# Altium schematic sheet DoserController.SchDoc
size A
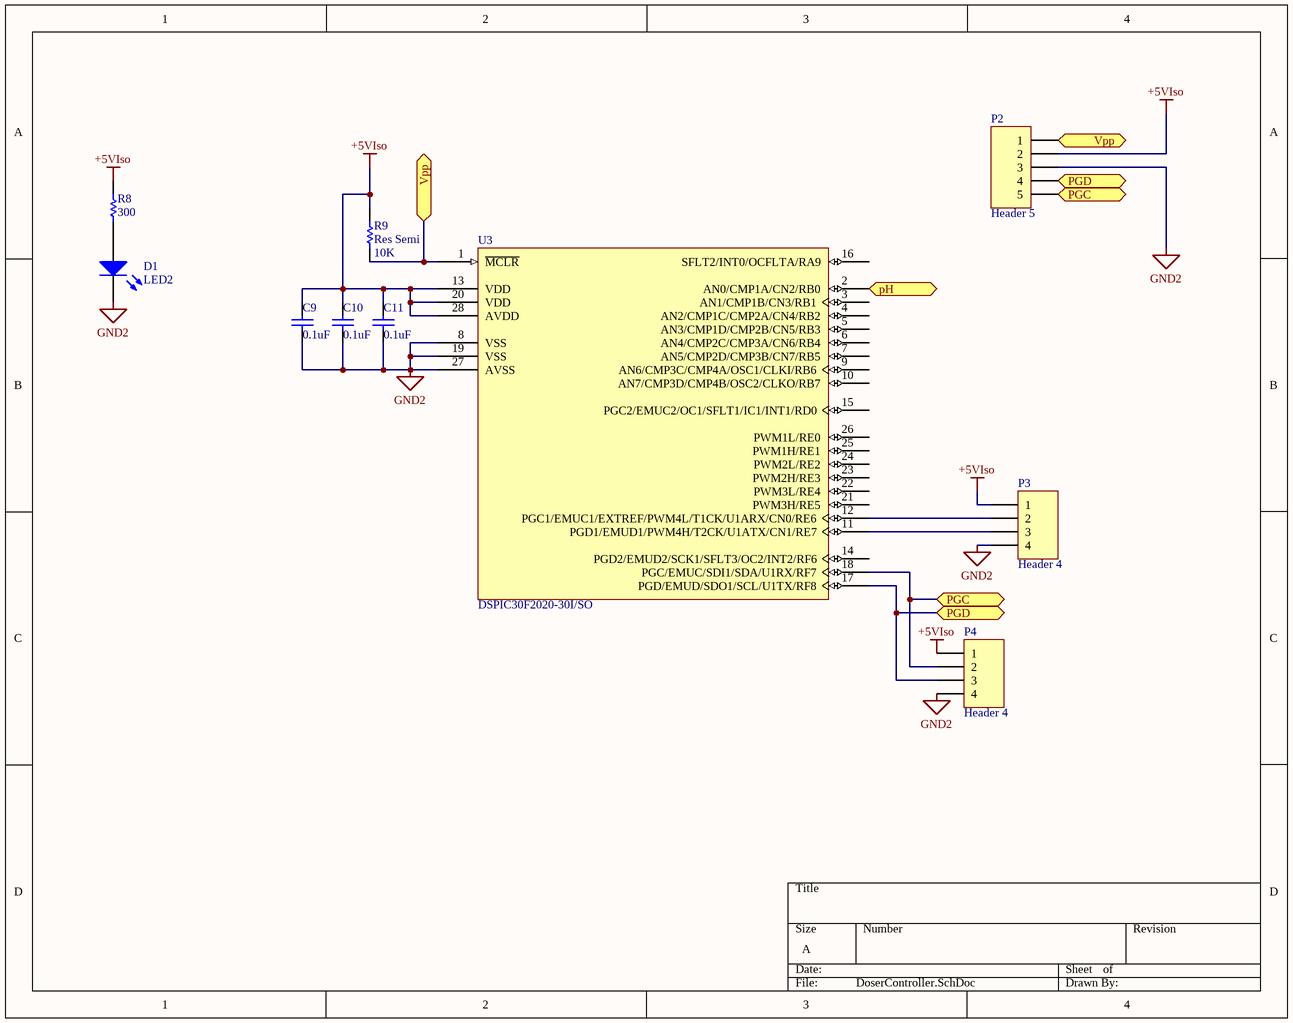
[diagram p0: DoserController.SchDoc]

## Parts
C9  value 0.1uF  [RESC2012L]  (hidden comment: Cap)
C10  value 0.1uF  [RESC2012L]  (hidden comment: Cap)
C11  value 0.1uF  [RESC2012L]  (hidden comment: Cap)
D1  LED2  [DSO-C2/D5.6]
P2  Header 5  [HDR1X5]
P3  Header 4  [HDR1X4]
P4  Header 4  [HDR1X4]
R8  value 300  [RESC2012L]  (hidden comment: Res1)
R9  Res Semi  value 10K  [RESC2012L]
U3  DSPIC30F2020-30I/SO  [SOIC-SO28_N]

## Ports
PGC, PGD, pH, Vpp

## Nets
+5VIso: C9.2 C10.2 C11.2 P2.2 P3.1 P4.1 R8.2 R9.2 U3.13(VDD) U3.20(VDD) U3.28(AVDD)
GND2: C9.1 C10.1 C11.1 D1.2(K) P2.3 P3.4 P4.4 U3.8(VSS) U3.19(VSS) U3.27(AVSS)
PGC: P2.5 P4.2 U3.18(PGC/EMUC/SDI1/SDA/U1RX/RF7) ; port PGC
PGD: P2.4 P4.3 U3.17(PGD/EMUD/SDO1/SCL/U1TX/RF8) ; port PGD
pH: U3.2(AN0/CMP1A/CN2/RB0) ; port pH
Vpp: P2.1 R9.1 U3.1(~{MCLR}) ; port Vpp
NetD1_1: D1.1(A) R8.1
NetP3_2: P3.2 U3.12(PGC1/EMUC1/EXTREF/PWM4L/T1CK/U1ARX/CN0/RE6)
NetP3_3: P3.3 U3.11(PGD1/EMUD1/PWM4H/T2CK/U1ATX/CN1/RE7)

Not connected (* = marked no-connect by the designer): U3 3(AN1/CMP1B/CN3/RB1) 4(AN2/CMP1C/CMP2A/CN4/RB2) 5(AN3/CMP1D/CMP2B/CN5/RB3) 6(AN4/CMP2C/CMP3A/CN6/RB4) 7(AN5/CMP2D/CMP3B/CN7/RB5) 9(AN6/CMP3C/CMP4A/OSC1/CLKI/RB6) 10(AN7/CMP3D/CMP4B/OSC2/CLKO/RB7) 14(PGD2/EMUD2/SCK1/SFLT3/OC2/INT2/RF6) 15(PGC2/EMUC2/OC1/SFLT1/IC1/INT1/RD0) 16(SFLT2/INT0/OCFLTA/RA9) 21(PWM3H/RE5) 22(PWM3L/RE4) 23(PWM2H/RE3) 24(PWM2L/RE2) 25(PWM1H/RE1) 26(PWM1L/RE0)

## Library data of the parts
C9-C11 = Cap: Capacitor; Published: 8-Jun-2000; LatestRevisionDate: 17-Jul-2002; LatestRevisionNote: Re-released for DXP Platform.; PackageReference: RAD-0.3; Publisher: Altium Limited
D1 = LED2: Typical RED, GREEN, YELLOW, AMBER GaAs LED; Published: 8-Jun-2000; LatestRevisionDate: 17-Jul-2002; LatestRevisionNote: Re-released for DXP Platform.; PackageVersion: Feb-2002; PackageReference: 3.2X1.6X1.1; Publisher: Altium Limited
P2 = Header 5: Header, 5-Pin; LatestRevisionDate: 17-Jul-2002; LatestRevisionNote: Re-released for DXP Platform.; Publisher: Altium Limited
P3 P4 = Header 4: Header, 4-Pin; LatestRevisionDate: 17-Jul-2002; LatestRevisionNote: Re-released for DXP Platform.; Publisher: Altium Limited
R8 = Res1: Resistor; Published: 8-Jun-2000; LatestRevisionDate: 17-Jul-2002; LatestRevisionNote: Re-released for DXP Platform.; PackageReference: AXIAL-0.3; Publisher: Altium Limited
R9 = Res Semi: Semiconductor Resistor; Published: 8-Jun-2000; LatestRevisionDate: 17-Jul-2002; LatestRevisionNote: Re-released for DXP Platform.; PackageReference: AXIAL-0.5; Publisher: Altium Limited
U3 = DSPIC30F2020-30I/SO: High-Performance 16-bit Digital Signal Controller with Switch Mode Power Supply, 12 KB Flash, 512 Byte SRAM, 28-Pin SOIC, Industrial Temperature; FirstPublished: 29-Jan-2009; DatasheetVersion: revC, Nov-2006; PackageVersion: revBB, Aug-2009; PackageReference: SOIC-SO28; Publisher: Altium Limited; PackageDescription: 28-Lead Plastic Small Outline (SO) - Wide 7.50mm Body [SOIC]; Supplier 1: Digi-Key; Supplier Part Number 1: DSPIC30F2020-30I/SO-ND; Supplier 2: Farnell; Supplier Part Number 2: 1332026; Supplier 3: Newark; Supplier Part Number 3: 88K3882; Code_JEDEC: MS-013; ComponentLink1Description: Datasheet; ComponentLink1URL: http://ww1.microchip.com/downloads/en/DeviceDoc/70178C.pdf; ComponentLink2Description: Packaging Specification; ComponentLink2URL: http://www.microchip.com/stellent/groups/techpub_sg/documents/packagingspec/en012702.pdf; ComponentLink3Description: Microchip.com Home; ComponentLink3URL: http://www.microchip.com/